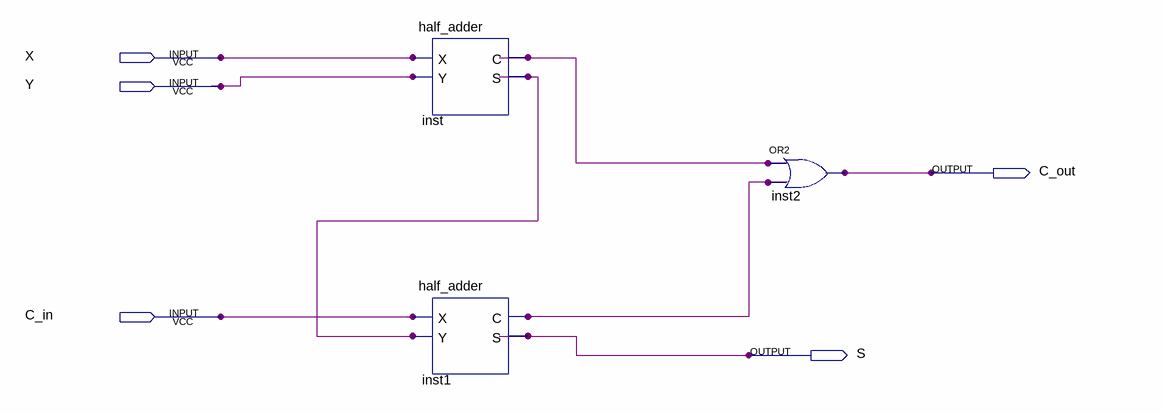
[diagram p0: schematic sheet]
// Quartus schematic full_adder.bdf as structural Verilog: 3 symbols, 5 pins
module full_adder (
  input  X,
  input  Y,
  input  C_in,
  output C_out,
  output S
);

  wire inst1_c, inst_c, inst_s;

  half_adder inst (.X(X), .Y(Y), .C(inst_c), .S(inst_s));
  half_adder inst1 (.X(C_in), .Y(inst_s), .C(inst1_c), .S(S));
  or inst2 (C_out, inst_c, inst1_c);
endmodule
